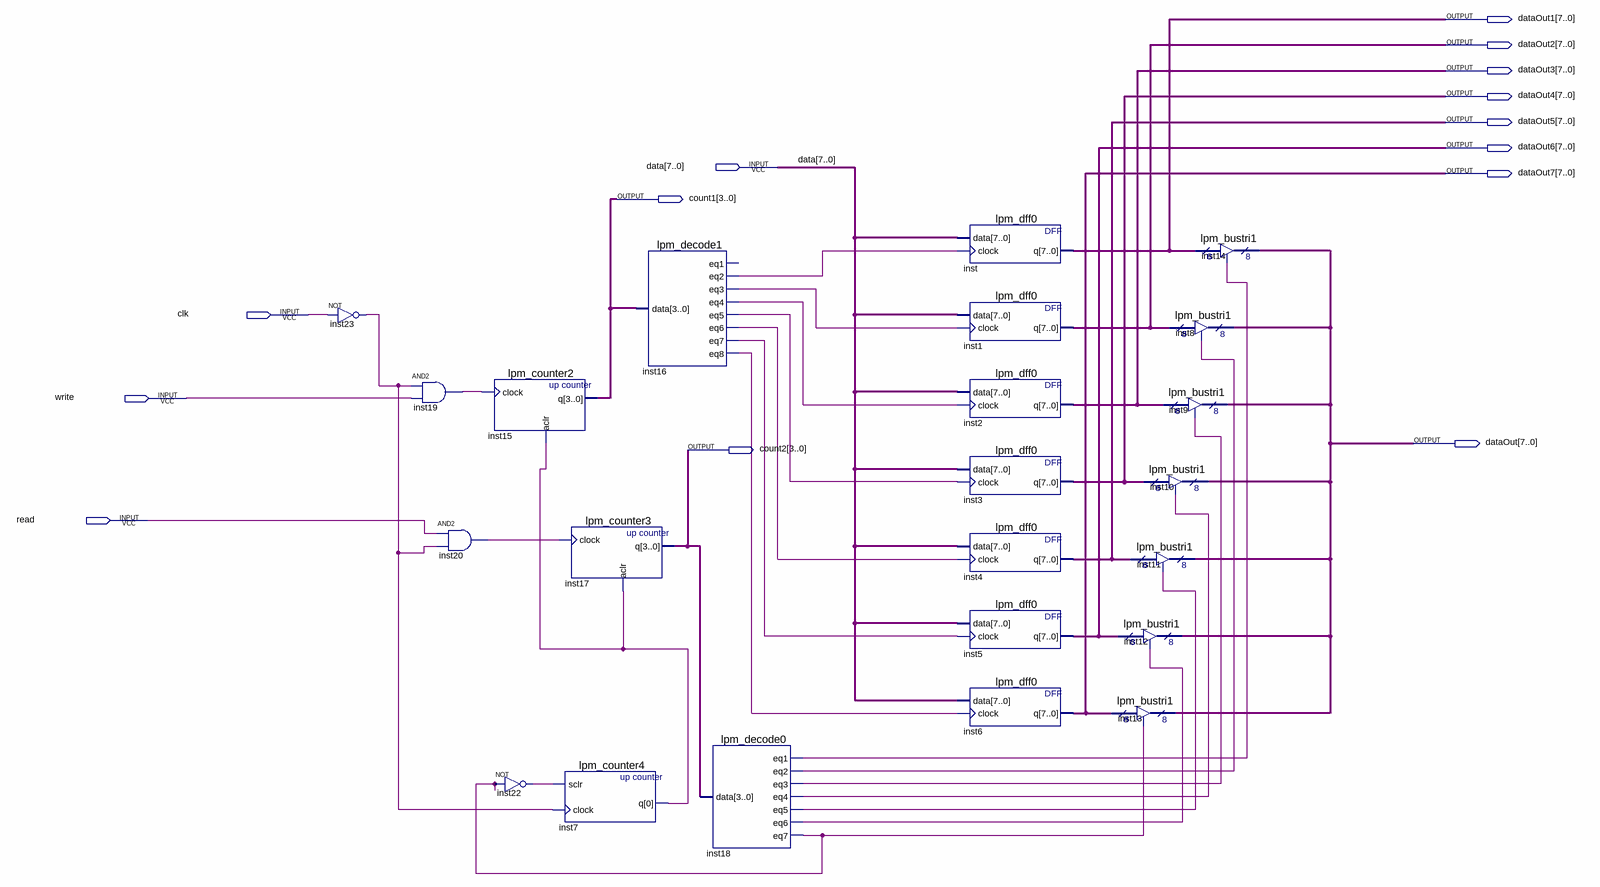
[diagram p0: schematic sheet]
// Quartus schematic buff.bdf as structural Verilog: 23 symbols, 14 pins
module buff (
  input  [7:0] data,
  input  clk,
  input  write,
  input  read,
  output [7:0] dataOut1,
  output [7:0] dataOut2,
  output [7:0] dataOut3,
  output [7:0] dataOut4,
  output [7:0] dataOut5,
  output [7:0] dataOut6,
  output [7:0] dataOut7,
  output [3:0] count1,
  output [7:0] dataOut,
  output [3:0] count2
);

  wire inst7_q, inst16_eq2, inst16_eq3, inst16_eq4, inst16_eq5, inst16_eq6, inst16_eq7, inst16_eq8,
       inst18_eq1, inst18_eq2, inst18_eq3, inst18_eq4, inst18_eq5, inst18_eq6, inst18_eq7, inst19_out,
       inst20_out, inst22_out, inst23_out;

  not inst23 (inst23_out, clk);
  and inst19 (inst19_out, inst23_out, write);
  and inst20 (inst20_out, read, inst23_out);
  lpm_counter2 inst15 (.clock(inst19_out), .aclr(inst7_q), .q(count1));
  not inst22 (inst22_out, inst18_eq7);
  lpm_counter3 inst17 (.clock(inst20_out), .aclr(inst7_q), .q(count2));
  lpm_counter4 inst7 (.sclr(inst22_out), .clock(inst23_out), .q(inst7_q));
  lpm_decode1 inst16 (
    .data(count1), .eq2(inst16_eq2), .eq3(inst16_eq3), .eq4(inst16_eq4), .eq5(inst16_eq5), .eq6(inst16_eq6),
    .eq7(inst16_eq7), .eq8(inst16_eq8));  // open: eq1
  lpm_decode0 inst18 (
    .data(count2), .eq1(inst18_eq1), .eq2(inst18_eq2), .eq3(inst18_eq3), .eq4(inst18_eq4), .eq5(inst18_eq5),
    .eq6(inst18_eq6), .eq7(inst18_eq7));
  lpm_dff0 inst (.data(data), .clock(inst16_eq2), .q(dataOut1));
  lpm_dff0 inst1 (.data(data), .clock(inst16_eq3), .q(dataOut2));
  lpm_dff0 inst2 (.data(data), .clock(inst16_eq4), .q(dataOut3));
  lpm_dff0 inst3 (.data(data), .clock(inst16_eq5), .q(dataOut4));
  lpm_dff0 inst4 (.data(data), .clock(inst16_eq6), .q(dataOut5));
  lpm_dff0 inst5 (.data(data), .clock(inst16_eq7), .q(dataOut6));
  lpm_dff0 inst6 (.data(data), .clock(inst16_eq8), .q(dataOut7));
  lpm_bustri1 inst13 (.enabledt(inst18_eq7), .data(dataOut7), .tridata(dataOut));
  lpm_bustri1 inst9 (.enabledt(inst18_eq3), .data(dataOut3), .tridata(dataOut));
  lpm_bustri1 inst10 (.enabledt(inst18_eq4), .data(dataOut4), .tridata(dataOut));
  lpm_bustri1 inst11 (.enabledt(inst18_eq5), .data(dataOut5), .tridata(dataOut));
  lpm_bustri1 inst12 (.enabledt(inst18_eq6), .data(dataOut6), .tridata(dataOut));
  lpm_bustri1 inst14 (.enabledt(inst18_eq1), .data(dataOut1), .tridata(dataOut));
  lpm_bustri1 inst8 (.enabledt(inst18_eq2), .data(dataOut2), .tridata(dataOut));
endmodule
